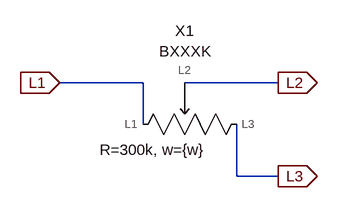
[diagram p0: schematic B300K.asc]
B300K.asc, the LTspice schematic file:
Version 4
SHEET 1 880 680
WIRE 96 160 -32 160
WIRE 304 160 160 160
WIRE 96 224 96 160
WIRE 240 304 240 224
WIRE 304 304 240 304
FLAG -32 160 L1
IOPIN -32 160 In
FLAG 304 160 L2
IOPIN 304 160 Out
FLAG 304 304 L3
IOPIN 304 304 Out
SYMBOL Base_BxxxK 160 176 R0
WINDOW 39 -49 87 Center 2
SYMATTR SpiceLine R=300k, w={w}
SYMATTR InstName X1
SYMATTR Description May be used for modeling linear potentiometers. Parameters: R, x. By default, R = 100 ohms and x is undefined. x must be within the range of [0, 1]. At x = 0, there will be no output signal.

The netlist it stands for:
* B300K.asc
XX1 L1 L2 L3 BXXXK R=300k, w={w}  ; pins L1 L2 L3
.backanno
.end